# EAGLE design Adaptador de Iluminacao (EAGLE 6.2)
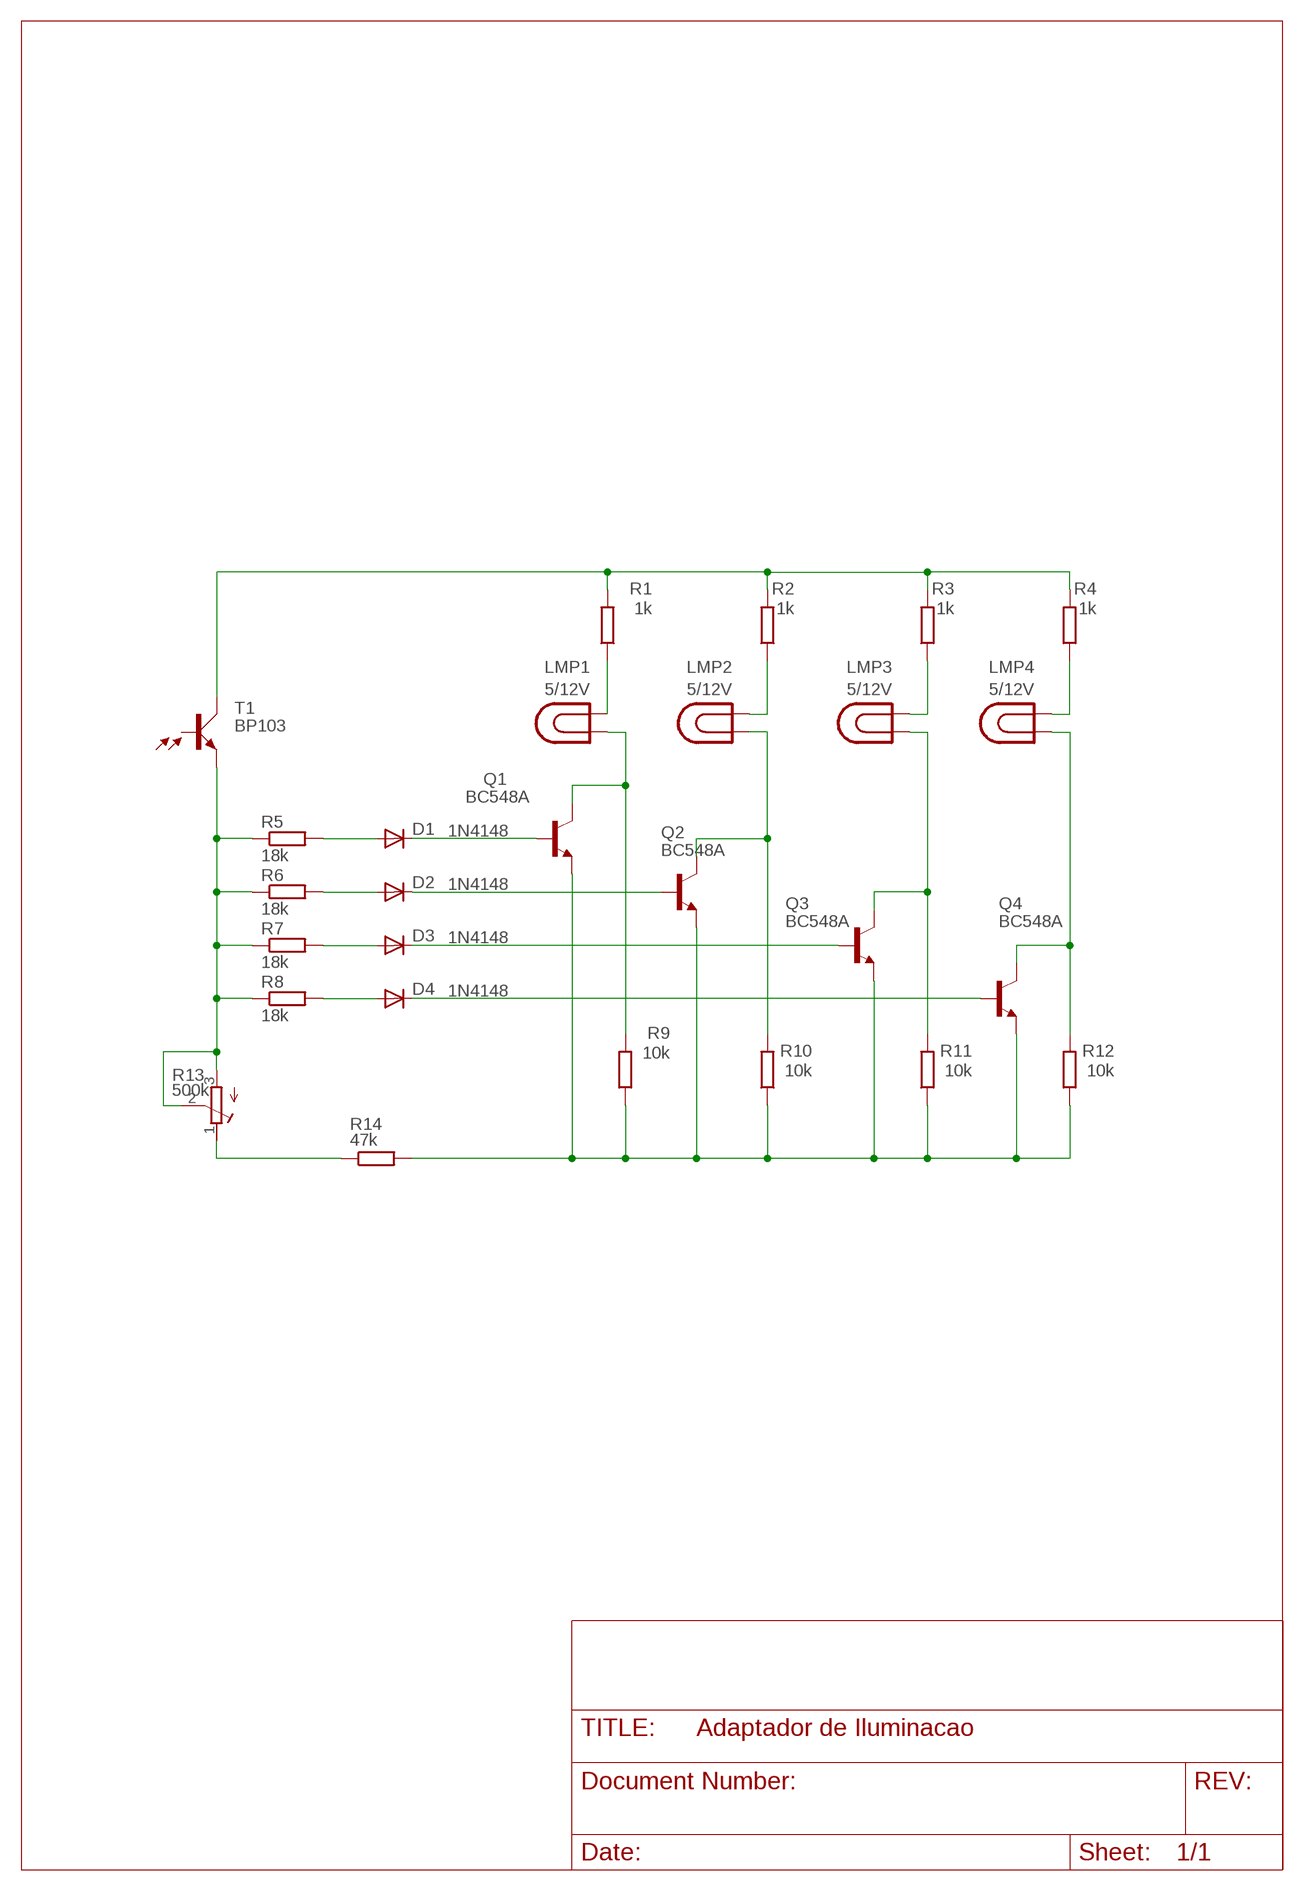
[diagram p0: schematic, sheet 1]

## Parts
D1  1N4148  1N4148DO35-7  [DO35-7]
D2  1N4148  1N4148DO35-7  [DO35-7]
D3  1N4148  1N4148DO35-7  [DO35-7]
D4  1N4148  1N4148DO35-7  [DO35-7]
LMP1  5/12V  LAMP  [LDH-5R]
LMP2  5/12V  LAMP  [LDH-5R]
LMP3  5/12V  LAMP  [LDH-5R]
LMP4  5/12V  LAMP  [LDH-5R]
Q1  BC548A  [TO92-EBC]
Q2  BC548A  [TO92-EBC]
Q3  BC548A  [TO92-EBC]
Q4  BC548A  [TO92-EBC]
R1  1k  R-EU_0207/10  [0207/10]
R2  1k  R-EU_0207/10  [0207/10]
R3  1k  R-EU_0207/10  [0207/10]
R4  1k  R-EU_0207/10  [0207/10]
R5  18k  R-EU_0207/10  [0207/10]
R6  18k  R-EU_0207/10  [0207/10]
R7  18k  R-EU_0207/10  [0207/10]
R8  18k  R-EU_0207/10  [0207/10]
R9  10k  R-EU_0207/10  [0207/10]
R10  10k  R-EU_0207/10  [0207/10]
R11  10k  R-EU_0207/10  [0207/10]
R12  10k  R-EU_0207/10  [0207/10]
R13  500k  R-TRIMM43P  [RTRIM43P]
R14  47k  R-EU_0207/10  [0207/10]
T1  BP103  [BP103]

## Nets
N$1: R5.1 R6.1 R7.1 R8.1 R13.2(S) R13.3(A) T1.E
N$2: D1.A R5.2
N$3: D2.A R6.2
N$4: D3.A R7.2
N$5: D4.A R8.2
N$6: R13.1(E) R14.1
N$7: D1.C Q1.B
N$8: Q1.E Q2.E Q3.E Q4.E R9.1 R10.1 R11.1 R12.1 R14.2
N$9: LMP1.1 Q1.C R9.2
N$10: LMP2.1 Q2.C R10.2
N$11: LMP1.2 R1.1
N$12: R1.2 R2.2 R3.2 R4.2 T1.C
N$13: LMP2.2 R2.1
N$14: D4.C Q4.B
N$15: D2.C Q2.B
N$17: D3.C Q3.B
N$18: LMP3.1 Q3.C R11.2
N$19: LMP4.1 Q4.C R12.2
N$20: LMP3.2 R3.1
N$22: LMP4.2 R4.1
Unconnected: T1.B

## Notes on the sheet
- Vitor Ivan DAngelo

## Library data of the parts
D1-D4 = diode:1N4148: DIODE high speed (Philips)
LMP1-LMP4 = special:LAMP: LED HOLDER
Q1-Q4 = transistor-npn:BC548*: NPN Transistor
R1-R12 R14 = rcl:R-EU_: RESISTOR, European symbol
R13 = rcl:R-TRIMM: Trimm resistor
T1 = opto-trans-siemens:BP103: PHOTO TRANSISTOR; OC_FARNELL: unknown; OC_NEWARK: unknown

## Board
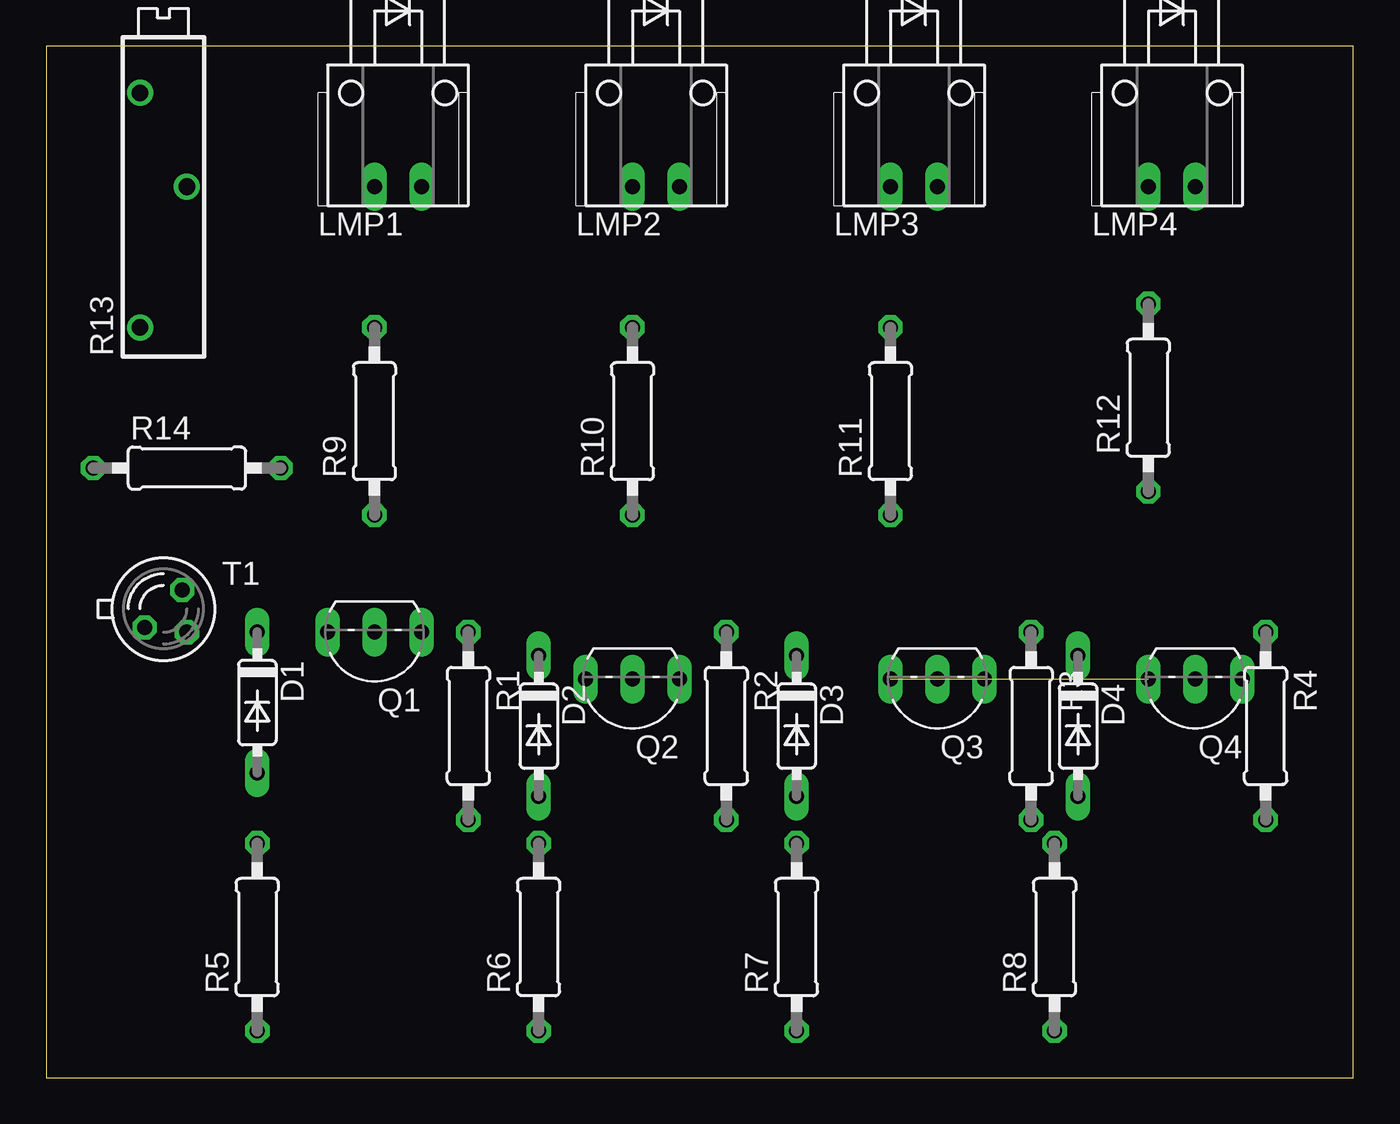
[diagram p1: board, top side]
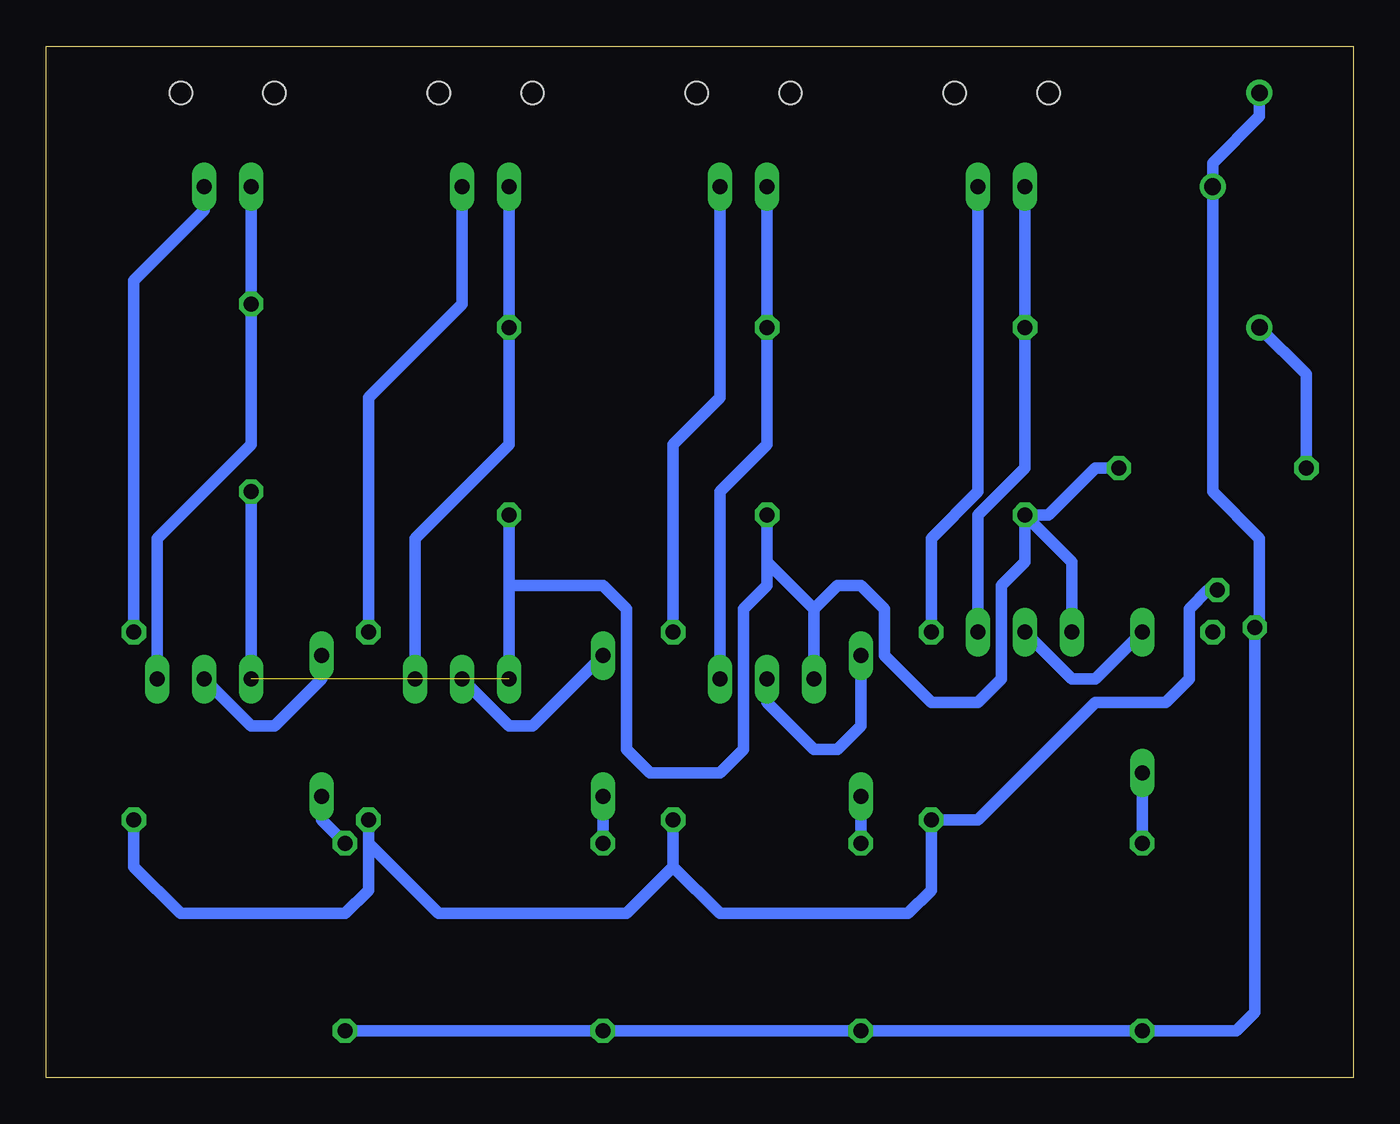
[diagram p2: board, bottom side, seen from below]

Size 70.79 x 55.87 mm. Coordinates in mm from the lower left corner, seen from the top.
Outline: 0,0 70.79,0 70.79,55.87 0,55.87 0,0
Copper layers (1*16): Top 0.035mm / dielectric 1.5mm / Bottom 0.035mm
Design rules: minimum track width 10mil, minimum drill 24mil, track to track 8mil, track to pad 8mil, pad to pad 8mil, via to via 8mil, smd to smd 8mil, copper to edge 40mil, drill to drill 8mil, minimum pad ring 10mil, minimum via ring 8mil, stop-mask expansion 4mil, vias tented up to drill 0mil, thermal gap 10mil

### Footprints (pad centres in the part's own frame; a part is rotated, then mirrored left to right if it is on the bottom)
DO35-7 = drill 0.813 long: A 3.81,0; C -3.81,0
LDH-5R = drill 0.813 long: 1 -1.27,-5.08; 2 1.27,-5.08 | hole 1.219: 2.54,0; -2.54,0
TO92-EBC = drill 0.813 long: B 0,-1.27; C -2.54,-1.27; E 2.54,-1.27
0207/10 = drill 0.813 octagon: 1 -5.08,0; 2 5.08,0
RTRIM43P = drill 0.9: 1 -7.62,1.27; 2 0,-1.27; 3 5.08,1.27
BP103 = drill 0.813 octagon: B 1.27,-1.27; C 1.016,1.016; E -1.016,-1.016

### Placement (x,y rotation side)
D1  11.43,20.32 270 top
D2  26.67,19.05 270 top
D3  40.64,19.05 270 top
D4  55.88,19.05 270 top
LMP1  19.05,53.34 0 top
LMP2  33.02,53.34 0 top
LMP3  46.99,53.34 0 top
LMP4  60.96,53.34 0 top
Q1  17.78,22.86 180 top
Q2  31.75,20.32 180 top
Q3  48.26,20.32 180 top
Q4  62.23,20.32 180 top
R1  22.86,19.05 270 top
R2  36.83,19.05 270 top
R3  53.34,19.05 270 top
R4  66.04,19.05 270 top
R5  11.43,7.62 90 top
R6  26.67,7.62 90 top
R7  40.64,7.62 90 top
R8  54.61,7.62 90 top
R9  17.78,35.56 90 top
R10  31.75,35.56 90 top
R11  45.72,35.56 90 top
R12  59.69,36.83 90 top
R13  6.35,48.26 90 top
R14  7.62,33.02 0 top
T1  6.35,25.4 0 top

### Tracks (layer width: path | path; a pad name or v marks a point on that pad's centre or on a via)
N$1
  Bottom 0.61: R13.3 5.08,52.07 7.62,49.53 R13.2 7.62,31.75 5.08,29.21 5.08,24.64 T1.E 5.33,3.56 6.35,2.54 R5.1 R6.1 R7.1 R8.1
N$2
  Bottom 0.61: R5.2 D1.A
N$3
  Bottom 0.61: R6.2 D2.A
N$4
  Bottom 0.61: R7.2 D3.A
N$5
  Bottom 0.61: R8.2 55.88,13.97 D4.A
N$6
  Bottom 0.61: R14.1 2.54,38.1 R13.1
N$7
  Bottom 0.61: D1.C 13.97,21.59 15.24,21.59 Q1.B
N$8  (1 unrouted)
  Bottom 0.61: R14.2 13.97,33.02 16.51,30.48 R9.1 | Q1.E 15.24,27.94 R9.1 | R12.1 Q4.E | R11.1 45.72,26.67 | 45.72,26.67 Q3.E | Q2.E 29.21,25.4 | 29.21,25.4 31.75,27.94 R10.1 31.75,26.67 33.02,25.4 33.02,17.78 34.29,16.51 38.1,16.51 39.37,17.78 39.37,25.4 40.64,26.67 45.72,26.67 | R9.1 17.78,27.94 19.05,26.67 19.05,21.59 20.32,20.32 22.86,20.32 25.4,22.86 25.4,25.4 26.67,26.67 27.94,26.67 29.21,25.4
N$9
  Bottom 0.61: LMP1.1 R9.2 17.78,33.02 20.32,30.48 Q1.C
N$10
  Bottom 0.61: LMP2.1 R10.2 31.75,34.29 34.29,31.75 Q2.C
N$11
  Bottom 0.61: LMP1.2 20.32,31.75 22.86,29.21 R1.1
N$12
  Bottom 0.61: 36.83,11.43 34.29,8.89 24.13,8.89 22.86,10.16 R1.2 20.32,13.97 13.97,20.32 10.16,20.32 8.89,21.59 8.89,25.4 7.87,26.42 T1.C | R2.2 36.83,11.43 | 36.83,11.43 39.37,8.89 49.53,8.89 53.34,12.7 R3.2 53.34,10.16 54.61,8.89 63.5,8.89 66.04,11.43 R4.2
N$13
  Bottom 0.61: LMP2.2 34.29,36.83 36.83,34.29 R2.1
N$14
  Bottom 0.61: D4.C 55.88,21.59 58.42,19.05 59.69,19.05 Q4.B
N$15
  Bottom 0.61: D2.C 26.67,19.05 27.94,17.78 29.21,17.78 31.75,20.32 Q2.B
N$17
  Bottom 0.61: D3.C 44.45,19.05 45.72,19.05 Q3.B
N$18
  Bottom 0.61: LMP3.1 R11.2 45.72,34.29 50.8,29.21 Q3.C
N$19
  Bottom 0.61: Q4.C 64.77,29.21 59.69,34.29 R12.2 LMP4.1
N$20
  Bottom 0.61: LMP3.2 48.26,41.91 53.34,36.83 R3.1
N$22
  Bottom 0.61: LMP4.2 62.23,46.99 66.04,43.18 R4.1